# Altium schematic sheet 12VDC_3V3DC_LM2596.SchDoc
size 381 x 241 mm; SheetNumber: 3; SheetTotal: 5
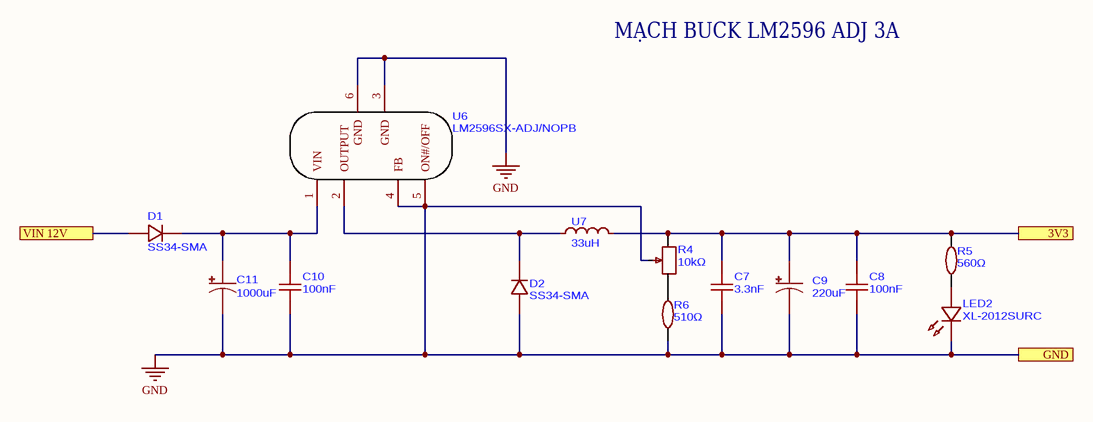
[diagram p0: 12VDC_3V3DC_LM2596.SchDoc]

## Parts
C7  3.3nF  [C0805]
C8  100nF  [C0805]
C9  220uF  [CAP-SMD_BD10.0-L10.3-W10.3-LS11.0-R-RD]
C10  100nF  [C0805]
C11  1000uF  [CAP-SMD_BD10.0-L10.3-W10.3-LS11.0-R-RD]
D1  SS34-SMA  [SMA_L4.3-W2.6-LS5.2-RD]
D2  SS34-SMA  [SMA_L4.3-W2.6-LS5.2-RD]
LED2  XL-2012SURC  [LED0805-RD_RED]
R4  10kΩ  [RES-ADJ-TH_3296W]
R5  560Ω  [R0805]
R6  510Ω  [R0805]
U6  LM2596SX-ADJ/NOPB  [TO-263-5_L10.2-W8.9-P1.70-TL]
U7  33uH  [IND-SMD_L10.0-W10.0_744066100]

## Ports
3V3 (see Merg_project[2B], ATmega32P[1A], ESP32[1A]), GND (see Merg_project[2B], 12VDC_5VDC_XL4015[4C], ATmega32P[1A], ESP32[1A]), VIN 12V (see Merg_project[2B], 12VDC_5VDC_XL4015[1B], ATmega32P[6D])

## Nets
GND: C7.1 C8.1 C9.2 C10.1 C11.2 D2.2 LED2.1(K) R4.2 R6.1 U6.3(GND) U6.4(FB) U6.5(ON#/OFF) U6.6(GND) ; port GND
3V3: C7.2 C8.2 C9.1 R4.1 R5.2 U7.2 ; port 3V3
VIN 12V: D1.2 ; port VIN 12V
NetC10_2: C10.2 C11.1 D1.1 U6.1(VIN)
NetD2_1: D2.1 U6.2(OUTPUT) U7.1
NetLED2_2: LED2.2(A) R5.1
NetR4_3: R4.3 R6.2

## Notes on the sheet
- MẠCH BUCK LM2596 ADJ 3A

## Library data of the parts
C7 C8 C10 = CC0805KRX7R9BB104
C9 C11 = VEJ102M1ATR-1010
R4 = 3296W-1-103_C330432
R5 R6 = RC0805FR-071KL
U7 = SRU1038-330Y